# EAGLE design schema (EAGLE 9.5.2)
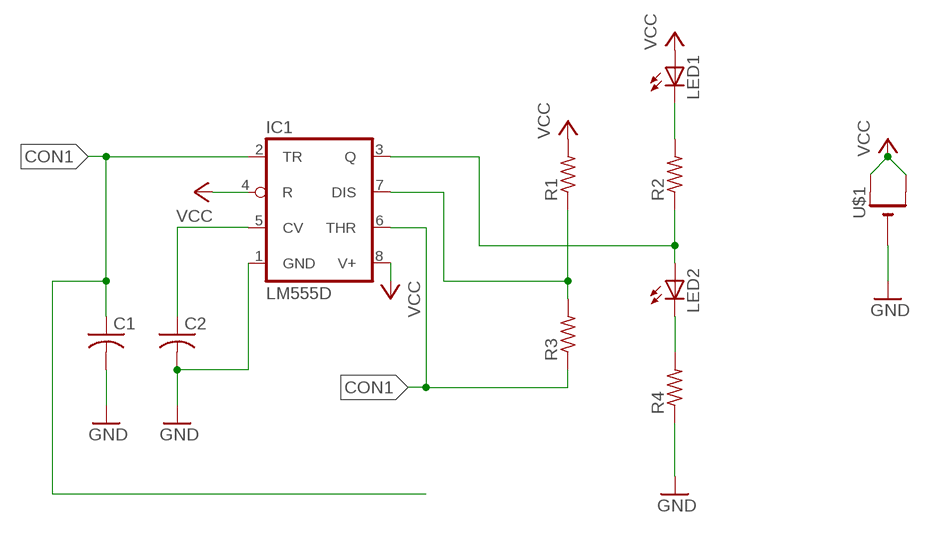
[diagram p0: schematic, sheet 1]

## Parts
C1  C-USC0805  [C0805]
C2  C-USC0805  [C0805]
IC1  LM555D  [SO08]
LED1  LEDCHIPLED_0805  [CHIPLED_0805]
LED2  LEDCHIPLED_0805  [CHIPLED_0805]
R1  R-US_R0805  [R0805]
R2  R-US_R0805  [R0805]
R3  R-US_R0805  [R0805]
R4  R-US_R0805  [R0805]
U$1  CR1220SMT  [CR1220-SMD]

## Nets
CON1: C1.1 IC1.2(TR) IC1.6(THR) R3.1
GND: C1.2 C2.2 IC1.1(GND) R4.1 U$1.-
N$1: C2.1 IC1.5(CV)
N$3: LED1.C R2.2
N$4: IC1.3(Q) LED2.A R2.1
N$5: LED2.C R4.2
N$6: IC1.7(DIS) R1.1 R3.2
VCC: IC1.4(R) IC1.8(V+) LED1.A R1.2 U$1.+$1(+) U$1.+$2(+1)

## Library data of the parts
C1 C2 = adafruit:C-US: CAPACITOR, American symbol
IC1 = adafruit:*555: TIMER Changed DIP package to have round (not oval) pin pads http://www.ladyada.net/library/pcb/eaglelibrary.html
LED1 LED2 = adafruit:LED: LED OSRAM: - CHIPLED LG R971, LG N971, LY N971, LG Q971, LY Q971, LO R971, LY R971 LH N974, LH R974 LS Q976, LO Q976, LY Q976 LO Q996 - Hyper CHIPLED LW Q18S LB Q993, LB Q99A, LB R99A - SideLED LS A670, LO A670, LY A670, LG A670, LP A670 LB A673, LV A673, LT A673, LW A673 LH A674 LY A675 LS A676, LA A676, LO A676, LY A676, LW A676 LS A679, LY A679, LG A679 - Hyper Micro SIDELED® LS Y876, LA Y876, LO Y876, LY Y876 LT Y87S - SmartLED LW L88C, LW L88S LB L89C, LB L89S, LG L890 LS L89K, LO L89K, LY L89K LS L896, LA L896, LO L896, LY L896 - TOPLED LS T670, LO T670, LY T670, LG T670, LP T670 LSG T670, LSP T670, LSY T670, LOP T670, LYG T670 LG T671, LOG T671, LSG T671 LB T673, LV T673, LT T673, LW T673 LH T674 LS T676, LA T676, LO T676, LY T676, LB T676, LH T676, LSB T676, LW T676 LB T67C, LV T67C, LT T67C, LS T67K, LO T67K, LY T67K, LW E67C LS E67B, LA E67B, LO E67B, LY E67B, LB E67C, LV E67C, LT E67C LW T67C LS T679, LY T679, LG T679 LS T770, LO T770, LY T770, LG T770, LP T770 LB T773, LV T773, LT T773, LW T773 LH T774 LS E675, LA E675, LY E675, LS T675 LS T776, LA T776, LO T776, LY T776, LB T776 LHGB T686 LT T68C, LB T68C - Hyper Mini TOPLED® LB M676 - Mini TOPLED Santana® LG M470 LS M47K, LO M47K, LY M47K Source: http://www.osram.convergy.de/
R1-R4 = adafruit:R-US_: RESISTOR, American symbol
U$1 = adafruit:CR1220: CR1216/CR1220/CR1225 12mm 3V lithium coin cell Great for battery packup. Both SMT and THM holders. Note the THM package has the ground pads on both sides of the PCB so that the masks are the same - this reduces the cost

## Net classes
0 default: width 0.305 mm, drill 0.508 mm, clearance 0.254 mm

## Board
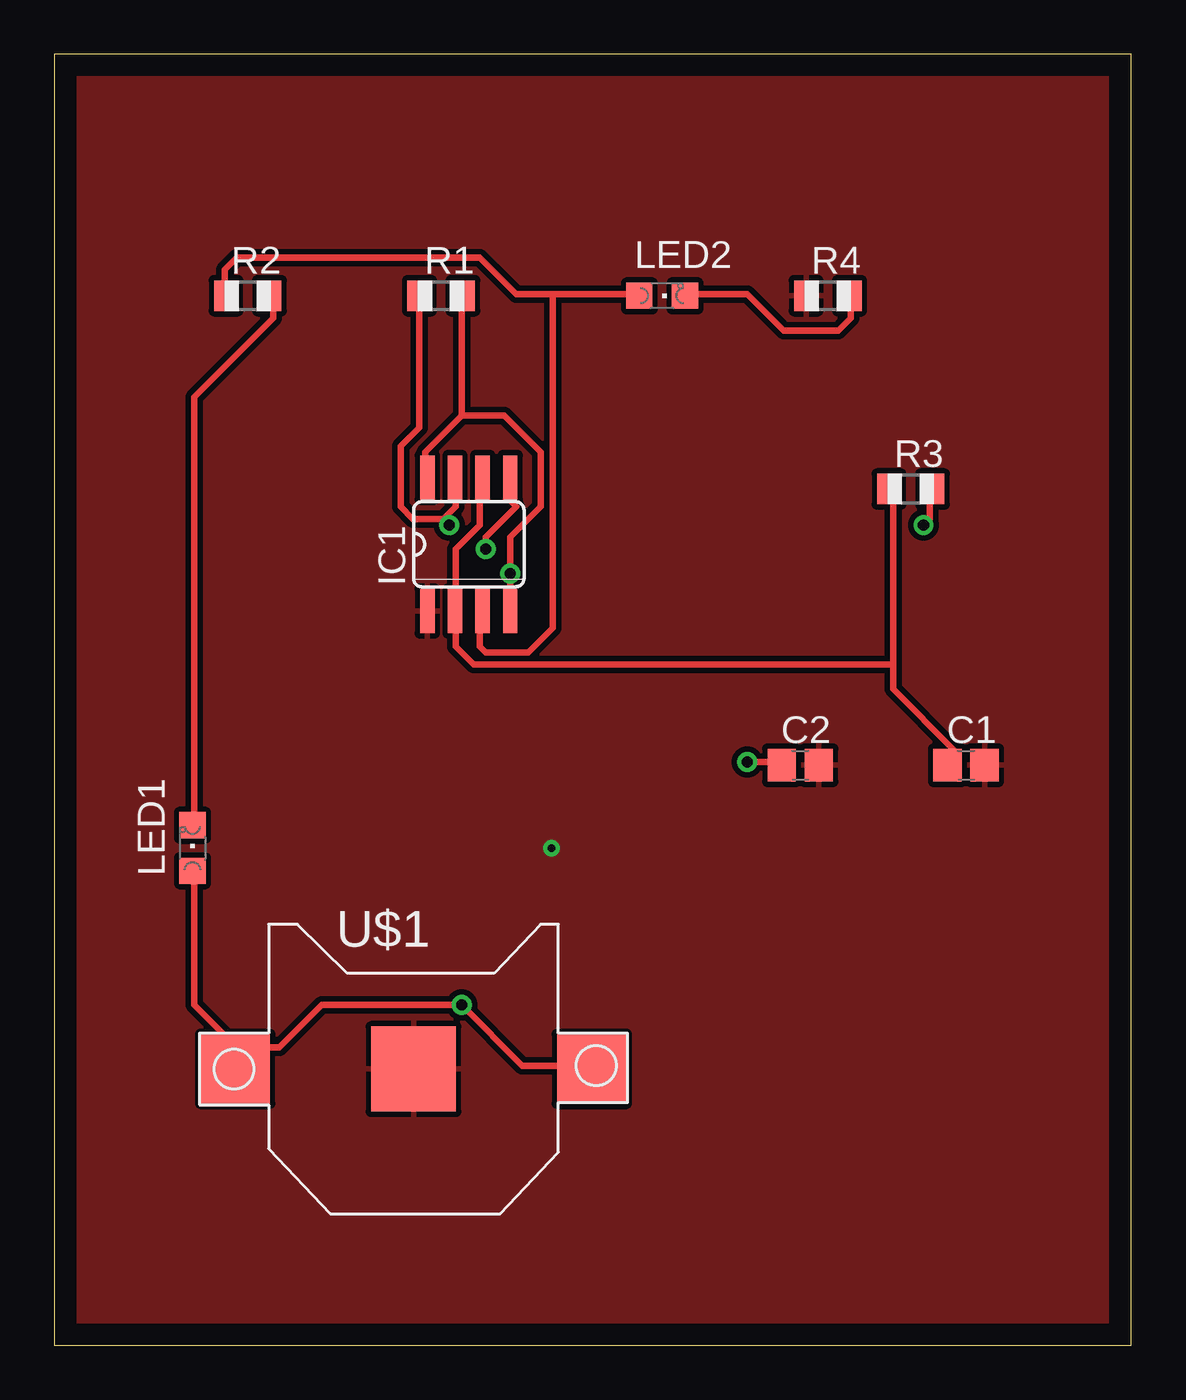
[diagram p1: board, top side]
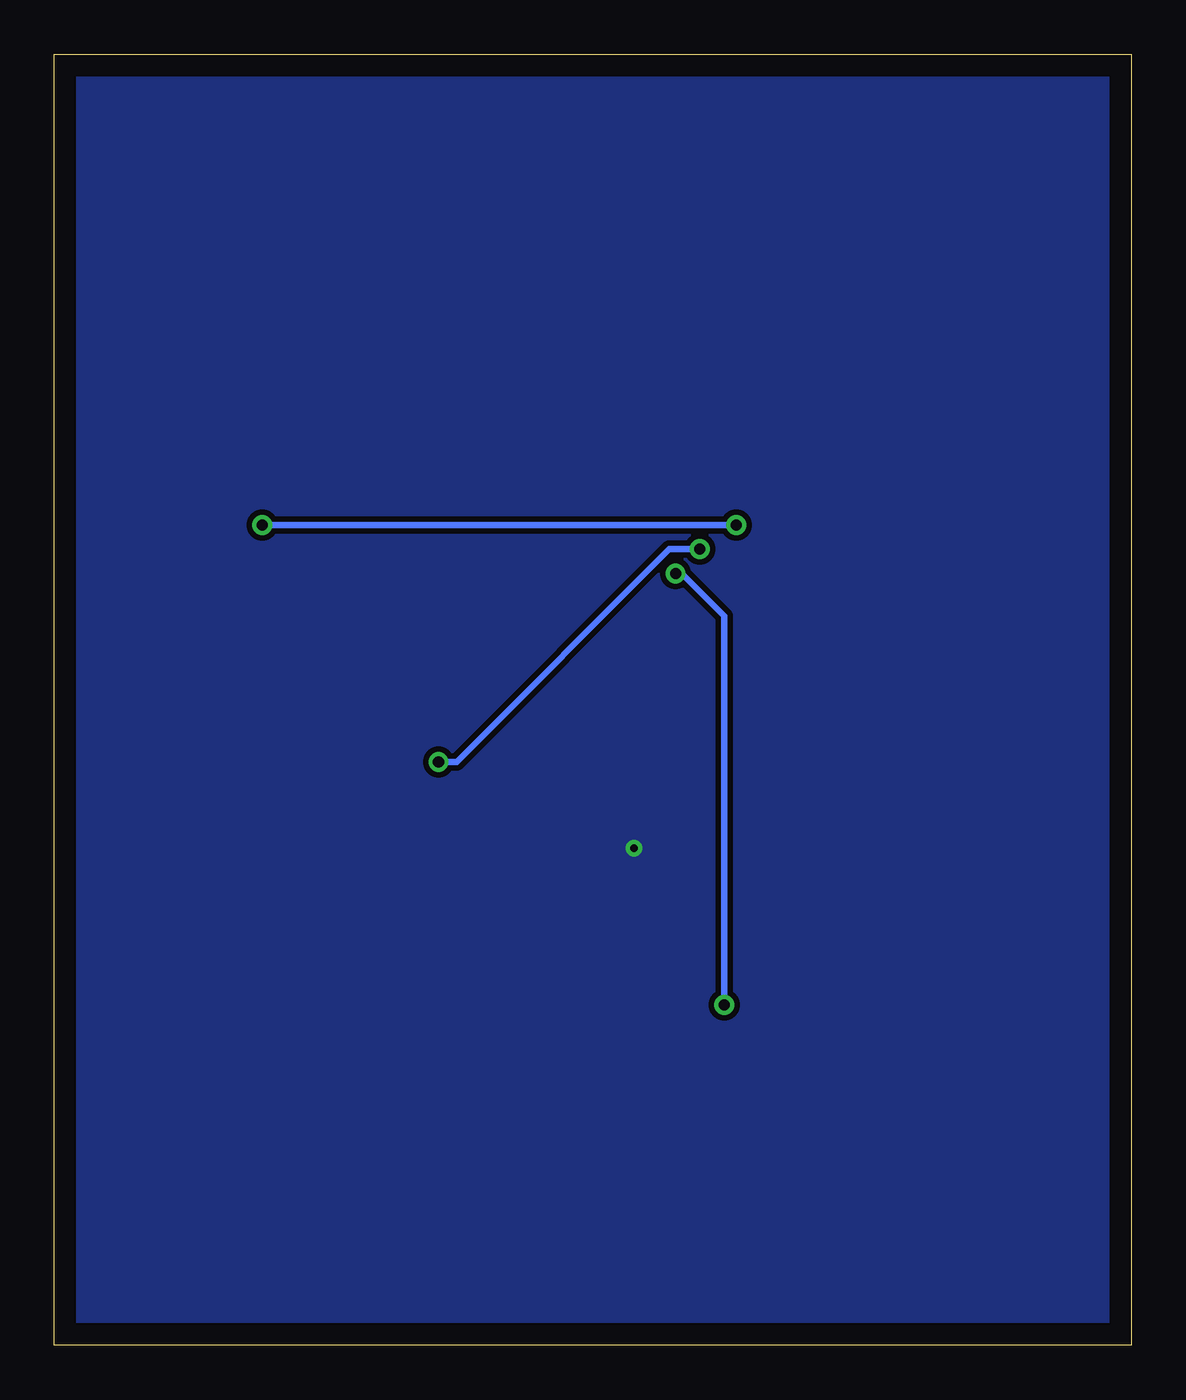
[diagram p2: board, bottom side, seen from below]

Size 49.51 x 59.36 mm. Coordinates in mm from the lower left corner, seen from the top.
Outline: 0,0 49.51,0 49.51,59.36 0,59.36 0,0
Copper layers (1*16): Top 0.035mm / dielectric 1.5mm / Bottom 0.035mm
Design rules "default": minimum track width 6mil, minimum drill 0.35mm, track to track 6mil, track to pad 6mil, pad to pad 6mil, via to via 6mil, smd to smd 6mil, copper to edge 40mil, drill to drill 6mil, minimum pad ring 10mil, minimum via ring 8mil, stop-mask expansion 4mil, vias tented up to drill 0mil, thermal gap 10mil

### Footprints (pad centres in the part's own frame; a part is rotated, then mirrored left to right if it is on the bottom)
C0805 = smd 1.3 x 1.5: 1 -0.85,0; 2 0.85,0
SO08 = smd 0.66 x 2.032: 1 -1.905,-3.073; 2 -0.635,-3.073; 3 0.635,-3.073; 4 1.905,-3.073; 5 1.905,3.073; 6 0.635,3.073; 7 -0.635,3.073; 8 -1.905,3.073
CHIPLED_0805 = smd 1.2 x 1.2: A 0,-1.05; C 0,1.05
R0805 = smd 1.1 x 1.4: 1 -1,0; 2 1,0
CR1220-SMD = smd 3.2 x 3.2: +$1 -8.2,0; +$2 8.2,0 | smd 3.9 x 3.9: - 0,0

### Placement (x,y rotation side)
C1  41.91,26.67 0 top
C2  34.29,26.67 0 top
IC1  19.05,36.83 0 top
LED1  6.35,22.86 0 top
LED2  27.94,48.26 270 top
R1  17.78,48.26 0 top
R2  8.89,48.26 0 top
R3  39.37,39.37 0 top
R4  35.56,48.26 0 top
U$1  16.51,12.7 0 top

### Tracks (layer width: path | path; a pad name or v marks a point on that pad's centre or on a via)
CON1
  Top 0.305: IC1.6 19.56,39.67 19.56,37.72 18.44,36.6 18.44,33.81 IC1.2 18.44,33.53 18.44,32.13 19.28,31.29 38.56,31.29 | 38.56,31.29 38.56,30.18 41.35,27.38 41.35,27.1 41.07,26.82 C1.1 | 38.56,31.29 38.56,39.12 R3.1
GND  (via drill 0.35)
  other vias: 22.86,22.86
  pour Top: -1.27,63.5 53.34,63.5 53.34,-5.08 -2.54,-5.08 -5.08,-2.54 -5.08,63.5
  pour Bottom: -1.27,59.69 -1.27,-1.27 0,-2.54 50.8,-2.54 50.8,62.23 0,62.23 -1.27,60.96
N$1  (via drill 0.51)
  Top 0.305: v31.85,26.82 33.25,26.82 C2.1 | v19.84,36.6 19.84,37.16 21.23,38.56 20.95,38.84 IC1.5
  Bottom 0.305: v31.85,26.82 31.01,26.82 21.23,36.6 v19.84,36.6
N$3
  Top 0.305: LED1.C 6.43,24.03 6.43,43.59 10.06,47.22 10.06,48.06 R2.2
N$4
  Top 0.305: 22.91,48.34 21.23,48.34 19.56,50.01 8.38,50.01 7.82,49.45 7.82,48.34 R2.1 | 22.91,48.34 26.82,48.34 LED2.A | 22.91,48.34 22.91,32.97 21.79,31.85 19.84,31.85 19.56,32.13 19.56,33.53 IC1.3
N$5
  Top 0.305: LED2.C 29.06,48.34 31.85,48.34 33.53,46.66 36.04,46.66 36.6,47.22 36.6,48.06 R4.2
N$6  (via drill 0.51)
  Top 0.305: 17.88,38 16.48,38 15.93,38.56 15.93,41.35 16.76,42.19 16.76,48.06 R1.1 | 17.88,38 18.44,38.56 18.44,39.67 IC1.7 | v39.95,37.72 40.23,38 40.23,39.12 R3.2 | 17.88,38 v18.16,37.72
  Bottom 0.305: v18.16,37.72 v39.95,37.72
VCC  (via drill 0.51)
  Top 0.305: 18.72,42.75 18.72,48.06 R1.2 | 18.72,42.75 17.04,41.07 17.04,39.95 IC1.8 | IC1.4 v20.95,35.48 20.95,37.16 22.35,38.56 22.35,41.07 20.68,42.75 18.72,42.75 | 8.1,13.69 8.1,12.85 U$1.+$1 8.1,13.69 | 8.1,13.69 8.1,13.97 6.43,15.65 6.43,21.79 LED1.A | 8.1,13.69 10.34,13.69 12.29,15.65 v18.72,15.65 21.51,12.85 24.59,12.85 U$1.+$2
  Bottom 0.305: v20.95,35.48 20.68,35.48 18.72,33.53 v18.72,15.65